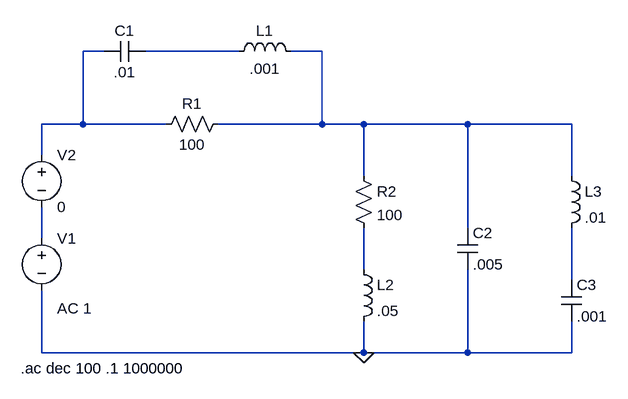
[diagram p0: schematic projet1circuit.asc]
projet1circuit.asc, the LTspice schematic file:
Version 4
SHEET 1 924 680
WIRE 144 -160 112 -160
WIRE 352 -160 208 -160
WIRE 480 -160 432 -160
WIRE 112 -48 112 -160
WIRE 112 -48 48 -48
WIRE 240 -48 112 -48
WIRE 480 -48 480 -160
WIRE 480 -48 320 -48
WIRE 544 -48 480 -48
WIRE 704 -48 544 -48
WIRE 864 -48 704 -48
WIRE 48 0 48 -48
WIRE 544 32 544 -48
WIRE 864 32 864 -48
WIRE 704 112 704 -48
WIRE 48 128 48 80
WIRE 544 176 544 112
WIRE 864 192 864 112
WIRE 48 304 48 208
WIRE 544 304 544 256
WIRE 544 304 48 304
WIRE 704 304 704 176
WIRE 704 304 544 304
WIRE 864 304 864 256
WIRE 864 304 704 304
FLAG 544 304 0
SYMBOL voltage 48 112 R0
WINDOW 123 24 124 Left 2
WINDOW 39 0 0 Left 0
SYMATTR Value2 AC 1
SYMATTR InstName V1
SYMATTR Value ""
SYMBOL voltage 48 -16 R0
WINDOW 123 0 0 Left 0
WINDOW 39 0 0 Left 0
SYMATTR InstName V2
SYMATTR Value 0
SYMBOL res 336 -64 R90
WINDOW 0 0 56 VBottom 2
WINDOW 3 32 56 VTop 2
SYMATTR InstName R1
SYMATTR Value 100
SYMBOL res 528 16 R0
SYMATTR InstName R2
SYMATTR Value 100
SYMBOL ind 336 -144 R270
WINDOW 0 32 56 VTop 2
WINDOW 3 5 56 VBottom 2
SYMATTR InstName L1
SYMATTR Value .001
SYMBOL ind 528 160 R0
SYMATTR InstName L2
SYMATTR Value .05
SYMBOL ind 848 16 R0
SYMATTR InstName L3
SYMATTR Value .01
SYMBOL cap 688 112 R0
SYMATTR InstName C2
SYMATTR Value .005
SYMBOL cap 848 192 R0
SYMATTR InstName C3
SYMATTR Value .001
SYMBOL cap 208 -176 R90
WINDOW 0 0 32 VBottom 2
WINDOW 3 32 32 VTop 2
SYMATTR InstName C1
SYMATTR Value .01
TEXT 16 328 Left 2 !.ac dec 100 .1 1000000

The netlist it stands for:
* projet1circuit.asc
V1 N004 0 AC 1
V2 N001 N004 0
R1 N003 N001 100
R2 N003 N005 100
L1 N002 N003 .001
L2 N005 0 .05
L3 N003 N006 .01
C2 N003 0 .005
C3 N006 0 .001
C1 N002 N001 .01
.ac dec 100 .1 1000000
.backanno
.end